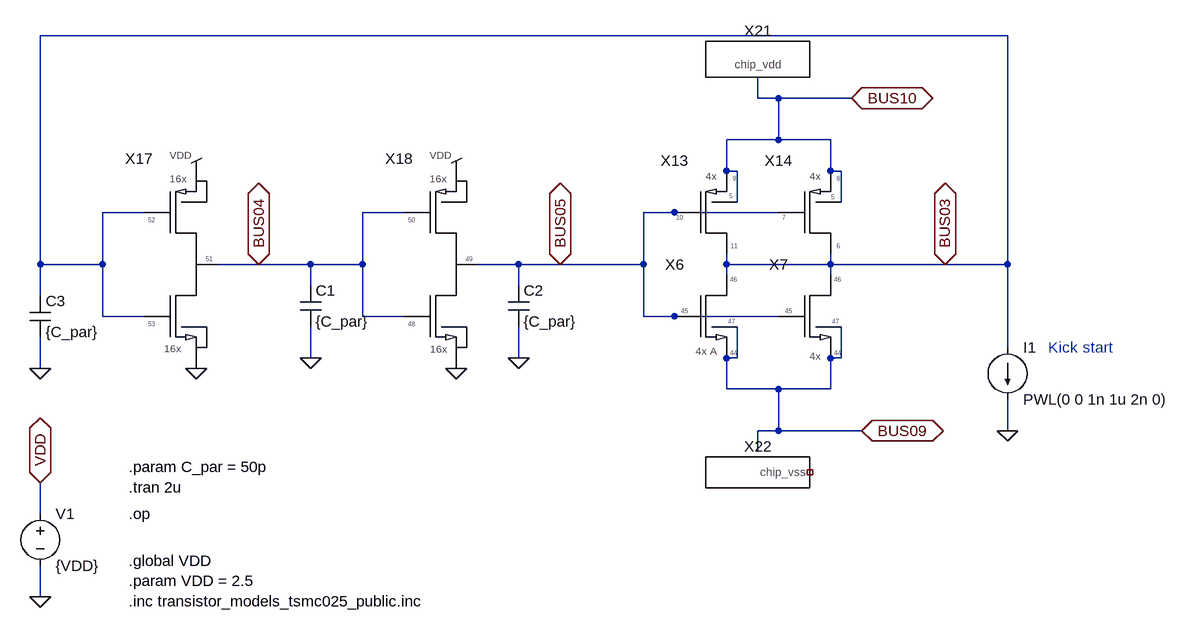
[diagram p0: schematic Example_Ring_Oscillator_3stage.asc]
Example_Ring_Oscillator_3stage.asc, the LTspice schematic file:
Version 4
SHEET 1 3920 996
WIRE 3664 -576 2176 -576
WIRE 3280 -480 3280 -512
WIRE 3312 -480 3280 -480
WIRE 3424 -480 3312 -480
WIRE 3312 -416 3312 -480
WIRE 3312 -416 3232 -416
WIRE 3392 -416 3312 -416
WIRE 3232 -368 3232 -416
WIRE 3248 -368 3232 -368
WIRE 3392 -368 3392 -416
WIRE 3408 -368 3392 -368
WIRE 3248 -320 3248 -368
WIRE 3408 -320 3408 -368
WIRE 2336 -304 2272 -304
WIRE 2736 -304 2672 -304
WIRE 3152 -304 3104 -304
WIRE 3312 -304 3152 -304
WIRE 2176 -224 2176 -576
WIRE 2272 -224 2272 -304
WIRE 2272 -224 2176 -224
WIRE 2512 -224 2448 -224
WIRE 2592 -224 2512 -224
WIRE 2672 -224 2672 -304
WIRE 2672 -224 2592 -224
WIRE 2912 -224 2848 -224
WIRE 2976 -224 2912 -224
WIRE 3104 -224 3104 -304
WIRE 3104 -224 2976 -224
WIRE 3232 -224 3232 -240
WIRE 3392 -224 3392 -240
WIRE 3392 -224 3232 -224
WIRE 3568 -224 3392 -224
WIRE 3664 -224 3664 -576
WIRE 3664 -224 3568 -224
WIRE 3232 -208 3232 -224
WIRE 3392 -208 3392 -224
WIRE 2592 -192 2592 -224
WIRE 2912 -192 2912 -224
WIRE 2176 -176 2176 -224
WIRE 2272 -144 2272 -224
WIRE 2336 -144 2272 -144
WIRE 2672 -144 2672 -224
WIRE 2736 -144 2672 -144
WIRE 3104 -144 3104 -224
WIRE 3152 -144 3104 -144
WIRE 3312 -144 3152 -144
WIRE 3664 -96 3664 -224
WIRE 2592 -80 2592 -128
WIRE 2912 -80 2912 -128
WIRE 3248 -80 3248 -128
WIRE 3248 -80 3232 -80
WIRE 3408 -80 3408 -128
WIRE 3408 -80 3392 -80
WIRE 2176 -64 2176 -112
WIRE 3232 -32 3232 -80
WIRE 3312 -32 3232 -32
WIRE 3392 -32 3392 -80
WIRE 3392 -32 3312 -32
WIRE 3312 32 3312 -32
WIRE 3312 32 3280 32
WIRE 3440 32 3312 32
WIRE 3664 32 3664 -16
WIRE 3280 64 3280 32
WIRE 2176 160 2176 112
WIRE 2176 288 2176 240
FLAG 3568 -224 BUS03
IOPIN 3568 -224 BiDir
FLAG 2512 -224 BUS04
IOPIN 2512 -224 BiDir
FLAG 2976 -224 BUS05
IOPIN 2976 -224 BiDir
FLAG 3440 32 BUS09
IOPIN 3440 32 BiDir
FLAG 3424 -480 BUS10
IOPIN 3424 -480 BiDir
FLAG 2176 112 VDD
IOPIN 2176 112 BiDir
FLAG 2176 288 0
FLAG 3664 32 0
FLAG 2912 -80 0
FLAG 2592 -80 0
FLAG 2176 -64 0
SYMBOL DP_nMOS_4x_A 3184 -192 R0
SYMATTR InstName X6
SYMBOL DP_nMOS_4x_B 3344 -192 R0
SYMATTR InstName X7
SYMBOL voltage 2176 144 R0
SYMATTR InstName V1
SYMATTR Value {VDD}
SYMBOL DP_pMOS_4x_A 3168 -352 R0
SYMATTR InstName X13
SYMBOL DP_pMOS_4x_B 3328 -352 R0
SYMATTR InstName X14
SYMBOL inverter_A 2352 -352 R0
WINDOW 0 -24 -19 Bottom 2
SYMATTR InstName X17
SYMBOL inverter_B 2752 -352 R0
WINDOW 0 -24 -19 Bottom 2
SYMATTR InstName X18
SYMBOL chip_vdd 3280 -544 R0
SYMATTR InstName X21
SYMBOL chip_vss 3280 96 R0
SYMATTR InstName X22
SYMBOL current 3664 -96 R0
SYMATTR InstName I1
SYMATTR Value PWL(0 0 1n 1u 2n 0)
SYMBOL Cap 2576 -192 R0
SYMATTR InstName C1
SYMATTR Value {C_par}
SYMBOL Cap 2896 -192 R0
SYMATTR InstName C2
SYMATTR Value {C_par}
SYMBOL Cap 2160 -176 R0
SYMATTR InstName C3
SYMATTR Value {C_par}
TEXT 2312 232 Left 2 !.global VDD\n.param VDD = 2.5\n.inc transistor_models_tsmc025_public.inc
TEXT 2312 160 Left 2 !.op
TEXT 2312 88 Left 2 !.param C_par = 50p\n.tran 2u
TEXT 3776 -96 Center 2 ;Kick start

The netlist it stands for:
* Example_Ring_Oscillator_3stage.asc
XX6 BUS05 BUS03 BUS09 BUS09 DP_nMOS_4x_A  ; pins gate drain source substrate
XX7 BUS05 BUS03 BUS09 BUS09 DP_nMOS_4x_B  ; pins gate drain source substrate
V1 VDD 0 {VDD}
XX13 BUS03 BUS05 BUS10 BUS10 DP_pMOS_4x_A  ; pins drain gate source nwell
XX14 BUS03 BUS05 BUS10 BUS10 DP_pMOS_4x_B  ; pins drain gate source nwell
XX17 BUS03 BUS03 BUS04 inverter_A  ; pins inn inp out
XX18 BUS04 BUS04 BUS05 inverter_B  ; pins inn inp out
XX21 BUS10 chip_vdd  ; pins chip_vdd
XX22 NC_01 chip_vss  ; pins chip_vss
I1 BUS03 0 PWL(0 0 1n 1u 2n 0)
C1 BUS04 0 {C_par}
C2 BUS05 0 {C_par}
C3 BUS03 0 {C_par}
.global VDD
.param VDD = 2.5
.inc transistor_models_tsmc025_public.inc
.op
.param C_par = 50p
.tran 2u
* Kick start
.backanno
.end